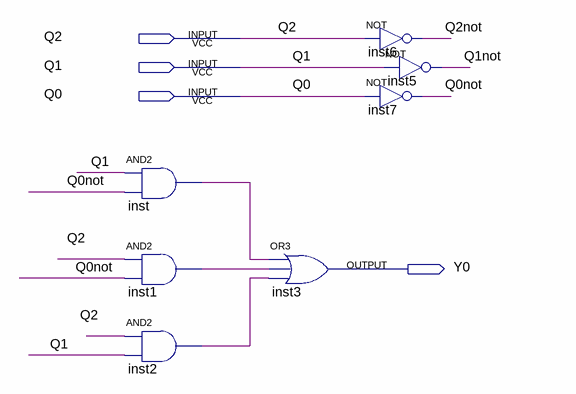
[diagram p0: schematic sheet]
// Quartus schematic Y0.bdf as structural Verilog: 7 symbols, 4 pins
module Y0 (
  input  Q2,
  input  Q1,
  input  Q0,
  output Y0
);

  wire inst1_out, inst2_out, inst_out, Q0not, Q1not, Q2not;

  and inst (inst_out, Q1, Q0not);
  and inst1 (inst1_out, Q2, Q0not);
  and inst2 (inst2_out, Q2, Q1);
  or inst3 (Y0, inst_out, inst1_out, inst2_out);
  not inst6 (Q2not, Q2);
  not inst5 (Q1not, Q1);
  not inst7 (Q0not, Q0);
endmodule
